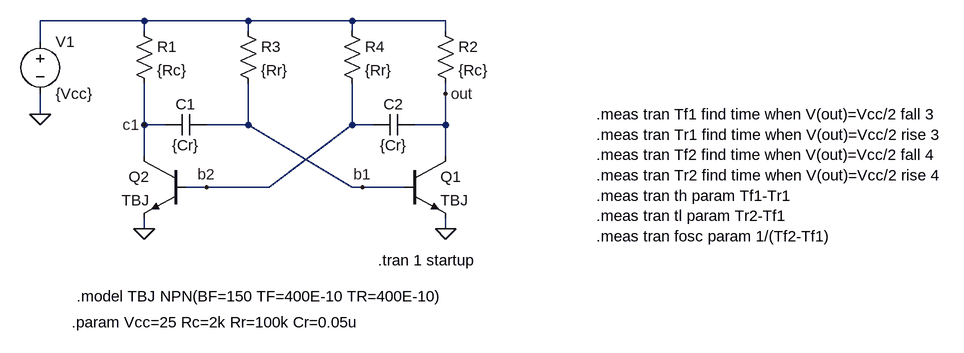
[diagram p0: schematic astable.asc]
astable.asc, the LTspice schematic file:
Version 4
SHEET 1 1652 1248
WIRE -560 768 -720 768
WIRE -400 768 -560 768
WIRE -240 768 -400 768
WIRE -96 768 -240 768
WIRE -560 784 -560 768
WIRE -400 784 -400 768
WIRE -240 784 -240 768
WIRE -96 784 -96 768
WIRE -720 800 -720 768
WIRE -96 880 -96 864
WIRE -720 912 -720 880
WIRE -560 928 -560 864
WIRE -528 928 -560 928
WIRE -400 928 -400 864
WIRE -400 928 -464 928
WIRE -240 928 -240 864
WIRE -208 928 -240 928
WIRE -96 928 -96 880
WIRE -96 928 -144 928
WIRE -560 976 -560 928
WIRE -96 976 -96 928
WIRE -464 1024 -496 1024
WIRE -368 1024 -240 928
WIRE -368 1024 -464 1024
WIRE -240 1024 -400 928
WIRE -224 1024 -240 1024
WIRE -160 1024 -224 1024
WIRE -560 1088 -560 1072
WIRE -96 1088 -96 1072
FLAG -96 1088 0
FLAG -560 1088 0
FLAG -720 912 0
FLAG -96 880 out
FLAG -224 1024 b1
FLAG -464 1024 b2
FLAG -560 928 c1
SYMBOL RES -576 768 R0
SYMATTR InstName R1
SYMATTR Value {Rc}
SYMBOL res -112 768 R0
SYMATTR InstName R2
SYMATTR Value {Rc}
SYMBOL res -416 768 R0
SYMATTR InstName R3
SYMATTR Value {Rr}
SYMBOL res -256 768 R0
SYMATTR InstName R4
SYMATTR Value {Rr}
SYMBOL cap -464 912 R90
WINDOW 0 0 32 VBottom 2
WINDOW 3 32 32 VTop 2
SYMATTR InstName C1
SYMATTR Value {Cr}
SYMBOL cap -144 912 R90
WINDOW 0 0 32 VBottom 2
WINDOW 3 32 32 VTop 2
SYMATTR InstName C2
SYMATTR Value {Cr}
SYMBOL VOLTAGE -720 784 R0
SYMATTR InstName V1
SYMATTR Value {Vcc}
SYMBOL NPN -160 976 R0
SYMATTR InstName Q1
SYMATTR Value TBJ
SYMBOL npn -496 976 M0
SYMATTR InstName Q2
SYMATTR Value TBJ
TEXT -200 1136 Left 2 !.tran 1 startup
TEXT 136 912 Left 2 !.meas tran Tf1 find time when V(out)=Vcc/2 fall 3\n.meas tran Tr1 find time when V(out)=Vcc/2 rise 3\n.meas tran Tf2 find time when V(out)=Vcc/2 fall 4\n.meas tran Tr2 find time when V(out)=Vcc/2 rise 4\n.meas tran th param Tf1-Tr1\n.meas tran tl param Tr2-Tf1\n.meas tran fosc param 1/(Tf2-Tf1)
TEXT -672 1232 Left 2 !.param Vcc=25 Rc=2k Rr=100k Cr=0.05u
TEXT -664 1192 Left 2 !.model TBJ NPN(BF=150 TF=400E-10 TR=400E-10)

The netlist it stands for:
* astable.asc
R1 N001 c1 {Rc}
R2 N001 out {Rc}
R3 N001 b1 {Rr}
R4 N001 b2 {Rr}
C1 b1 c1 {Cr}
C2 out b2 {Cr}
V1 N001 0 {Vcc}
Q1 out b1 0 0 TBJ
Q2 c1 b2 0 0 TBJ
.model NPN NPN
.model PNP PNP
.lib standard.bjt
.tran 1 startup
.meas tran Tf1 find time when V(out)=Vcc/2 fall 3
.meas tran Tr1 find time when V(out)=Vcc/2 rise 3
.meas tran Tf2 find time when V(out)=Vcc/2 fall 4
.meas tran Tr2 find time when V(out)=Vcc/2 rise 4
.meas tran th param Tf1-Tr1
.meas tran tl param Tr2-Tf1
.meas tran fosc param 1/(Tf2-Tf1)
.param Vcc=25 Rc=2k Rr=100k Cr=0.05u
.model TBJ NPN(BF=150 TF=400E-10 TR=400E-10)
.backanno
.end